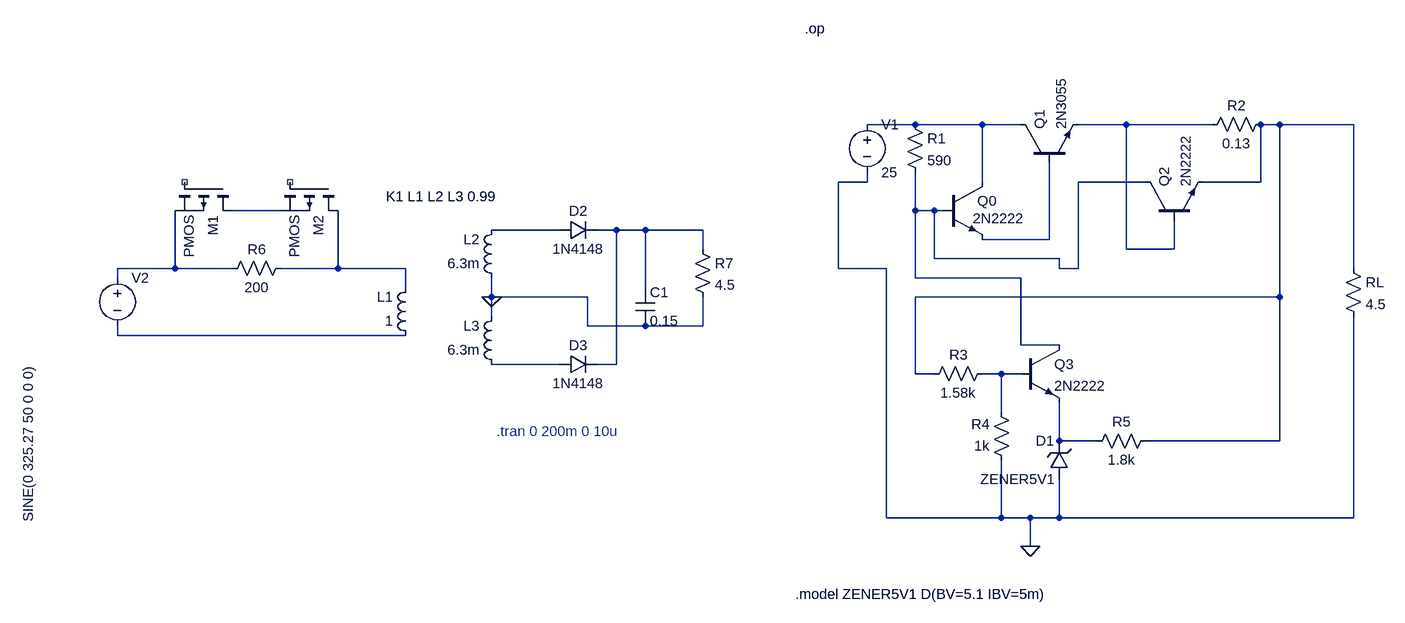
[diagram p0: schematic linear-regulator final....asc]
linear-regulator final....asc, the LTspice schematic file:
Version 4.1
SHEET 1 2704 768
WIRE 432 -304 352 -304
WIRE 544 -304 432 -304
WIRE 608 -304 544 -304
WIRE 784 -304 704 -304
WIRE 928 -304 784 -304
WIRE 1040 -304 1008 -304
WIRE 1248 -304 1040 -304
WIRE 352 -208 352 -224
WIRE 352 -208 304 -208
WIRE 544 -208 544 -304
WIRE 816 -208 704 -208
WIRE 1008 -208 1008 -304
WIRE 1008 -208 912 -208
WIRE -1216 -160 -1296 -160
WIRE 432 -160 432 -224
WIRE 464 -160 432 -160
WIRE 480 -160 464 -160
WIRE -752 -128 -864 -128
WIRE -656 -128 -688 -128
WIRE -608 -128 -656 -128
WIRE -512 -128 -608 -128
WIRE 656 -112 656 -240
WIRE 656 -112 544 -112
WIRE -512 -96 -512 -128
WIRE 784 -96 784 -304
WIRE 864 -96 864 -144
WIRE 864 -96 784 -96
WIRE 464 -80 464 -160
WIRE 672 -80 464 -80
WIRE -1392 -64 -1392 -160
WIRE -1392 -64 -1488 -64
WIRE -1296 -64 -1392 -64
WIRE -1120 -64 -1120 -160
WIRE -1120 -64 -1216 -64
WIRE -1008 -64 -1120 -64
WIRE 304 -64 304 -208
WIRE 384 -64 304 -64
WIRE 672 -64 672 -80
WIRE 704 -64 704 -208
WIRE 704 -64 672 -64
WIRE 1248 -64 1248 -304
WIRE -1488 -48 -1488 -64
WIRE 432 -48 432 -160
WIRE 608 -48 432 -48
WIRE -1008 -32 -1008 -64
WIRE -608 -32 -608 -128
WIRE -864 -16 -864 -48
WIRE -704 -16 -864 -16
WIRE 1040 -16 1040 -304
WIRE 1040 -16 432 -16
WIRE -864 16 -864 -16
WIRE -704 32 -704 -16
WIRE -608 32 -704 32
WIRE -512 32 -512 -16
WIRE -512 32 -608 32
WIRE -1488 48 -1488 32
WIRE -1008 48 -1488 48
WIRE 608 64 608 -48
WIRE 672 64 608 64
WIRE -752 96 -864 96
WIRE -656 96 -656 -128
WIRE -656 96 -688 96
WIRE 432 112 432 -16
WIRE 464 112 432 112
WIRE 576 112 544 112
WIRE 608 112 576 112
WIRE 576 176 576 112
WIRE 672 224 672 160
WIRE 736 224 672 224
WIRE 1040 224 1040 -16
WIRE 1040 224 816 224
WIRE 384 352 384 -64
WIRE 576 352 576 256
WIRE 576 352 384 352
WIRE 624 352 576 352
WIRE 672 352 672 288
WIRE 672 352 624 352
WIRE 1248 352 1248 16
WIRE 1248 352 672 352
WIRE 624 400 624 352
FLAG 624 400 0
FLAG -864 -16 0
SYMBOL npn 608 -240 R270
SYMATTR InstName Q1
SYMATTR Value 2N3055
SYMBOL npn 816 -144 R270
SYMATTR InstName Q2
SYMATTR Value 2N2222
SYMBOL npn 608 64 R0
SYMATTR InstName Q3
SYMATTR Value 2N2222
SYMBOL res 416 -320 R0
SYMATTR InstName R1
SYMATTR Value 590
SYMBOL res 1024 -320 R90
WINDOW 0 0 56 VBottom 2
WINDOW 3 32 56 VTop 2
SYMATTR InstName R2
SYMATTR Value 0.13
SYMBOL res 560 96 R90
WINDOW 0 0 56 VBottom 2
WINDOW 3 32 56 VTop 2
SYMATTR InstName R3
SYMATTR Value 1.58k
SYMBOL res 592 272 R180
WINDOW 0 36 76 Left 2
WINDOW 3 36 40 Left 2
SYMATTR InstName R4
SYMATTR Value 1k
SYMBOL res 720 240 R270
WINDOW 0 32 56 VTop 2
WINDOW 3 0 56 VBottom 2
SYMATTR InstName R5
SYMATTR Value 1.8k
SYMBOL zener 688 288 R180
WINDOW 0 24 64 Left 2
WINDOW 3 24 0 Left 2
SYMATTR InstName D1
SYMATTR Value ZENER5V1
SYMBOL res 1232 -80 R0
SYMATTR InstName RL
SYMATTR Value 4.5
SYMBOL voltage -1488 -64 R0
WINDOW 3 -755 423 VLeft 2
WINDOW 123 0 0 Left 0
WINDOW 39 0 0 Left 0
SYMATTR Value SINE(0 325.27 50 0 0 0)
SYMATTR InstName V2
SYMBOL ind -992 64 R180
WINDOW 0 36 80 Left 2
WINDOW 3 36 40 Left 2
SYMATTR InstName L1
SYMATTR Value 1
SYMATTR Type ind
SYMATTR SpiceLine Rser=1m
SYMBOL ind -848 -32 R180
WINDOW 0 36 80 Left 2
WINDOW 3 36 40 Left 2
SYMATTR InstName L2
SYMATTR Value 6.3m
SYMATTR Type ind
SYMATTR SpiceLine Rser=1m
SYMBOL ind -848 112 R180
WINDOW 0 36 80 Left 2
WINDOW 3 36 40 Left 2
SYMATTR InstName L3
SYMATTR Value 6.3m
SYMATTR Type ind
SYMATTR SpiceLine Rser=1m
SYMBOL diode -752 -112 R270
WINDOW 0 32 32 VTop 2
WINDOW 3 0 32 VBottom 2
SYMATTR InstName D2
SYMATTR Value 1N4148
SYMBOL diode -752 112 R270
WINDOW 0 32 32 VTop 2
WINDOW 3 0 32 VBottom 2
SYMATTR InstName D3
SYMATTR Value 1N4148
SYMBOL cap -624 -32 R0
SYMATTR InstName C1
SYMATTR Value 0.15
SYMBOL res -1200 -80 R90
WINDOW 0 0 56 VBottom 2
WINDOW 3 32 56 VTop 2
SYMATTR InstName R6
SYMATTR Value 200
SYMBOL res -528 -112 R0
SYMATTR InstName R7
SYMATTR Value 4.5
SYMBOL pmos -1296 -208 R90
SYMATTR InstName M1
SYMBOL pmos -1120 -208 R90
SYMATTR InstName M2
SYMBOL voltage 352 -320 R0
WINDOW 123 0 0 Left 0
WINDOW 39 0 0 Left 0
SYMATTR InstName V1
SYMATTR Value 25
SYMBOL npn 480 -208 R0
WINDOW 3 48 61 Left 2
SYMATTR InstName Q0
SYMATTR Value 2N2222
TEXT 232 480 Left 2 !.model ZENER5V1 D(BV=5.1 IBV=5m)
TEXT -1040 -184 Left 2 !K1 L1 L2 L3 0.99
TEXT -856 208 Left 2 ;.tran 0 200m 0 10u
TEXT 248 -464 Left 2 !.op

The netlist it stands for:
* linear-regulator final....asc
Q1 N001 N008 N002 0 2N3055
Q2 N004 N002 N003 0 2N2222
Q3 N004 N013 N014 0 2N2222
R1 N001 N004 590
R2 N003 N002 0.13
R3 N013 N003 1.58k
R4 0 N013 1k
R5 N014 N003 1.8k
D1 0 N014 ZENER5V1
RL N003 0 4.5
V2 N009 N011 SINE(0 325.27 50 0 0 0)
L1 N011 N010 1 Rser=1m
L2 0 N006 6.3m Rser=1m
L3 N012 0 6.3m Rser=1m
D2 N006 N007 1N4148
D3 N012 N007 1N4148
C1 N007 0 0.15
R6 N010 N009 200
R7 N007 0 4.5
M1 N005 NC_01 N009 N009 PMOS
M2 N010 NC_02 N005 N005 PMOS
V1 N001 0 25
Q0 N001 N004 N008 0 2N2222
.model D D
.lib standard.dio
.model NPN NPN
.model PNP PNP
.lib standard.bjt
.model NMOS NMOS
.model PMOS PMOS
.lib standard.mos
.model ZENER5V1 D(BV=5.1 IBV=5m)
K1 L1 L2 L3 0.99
* .tran 0 200m 0 10u
.op
.backanno
.end